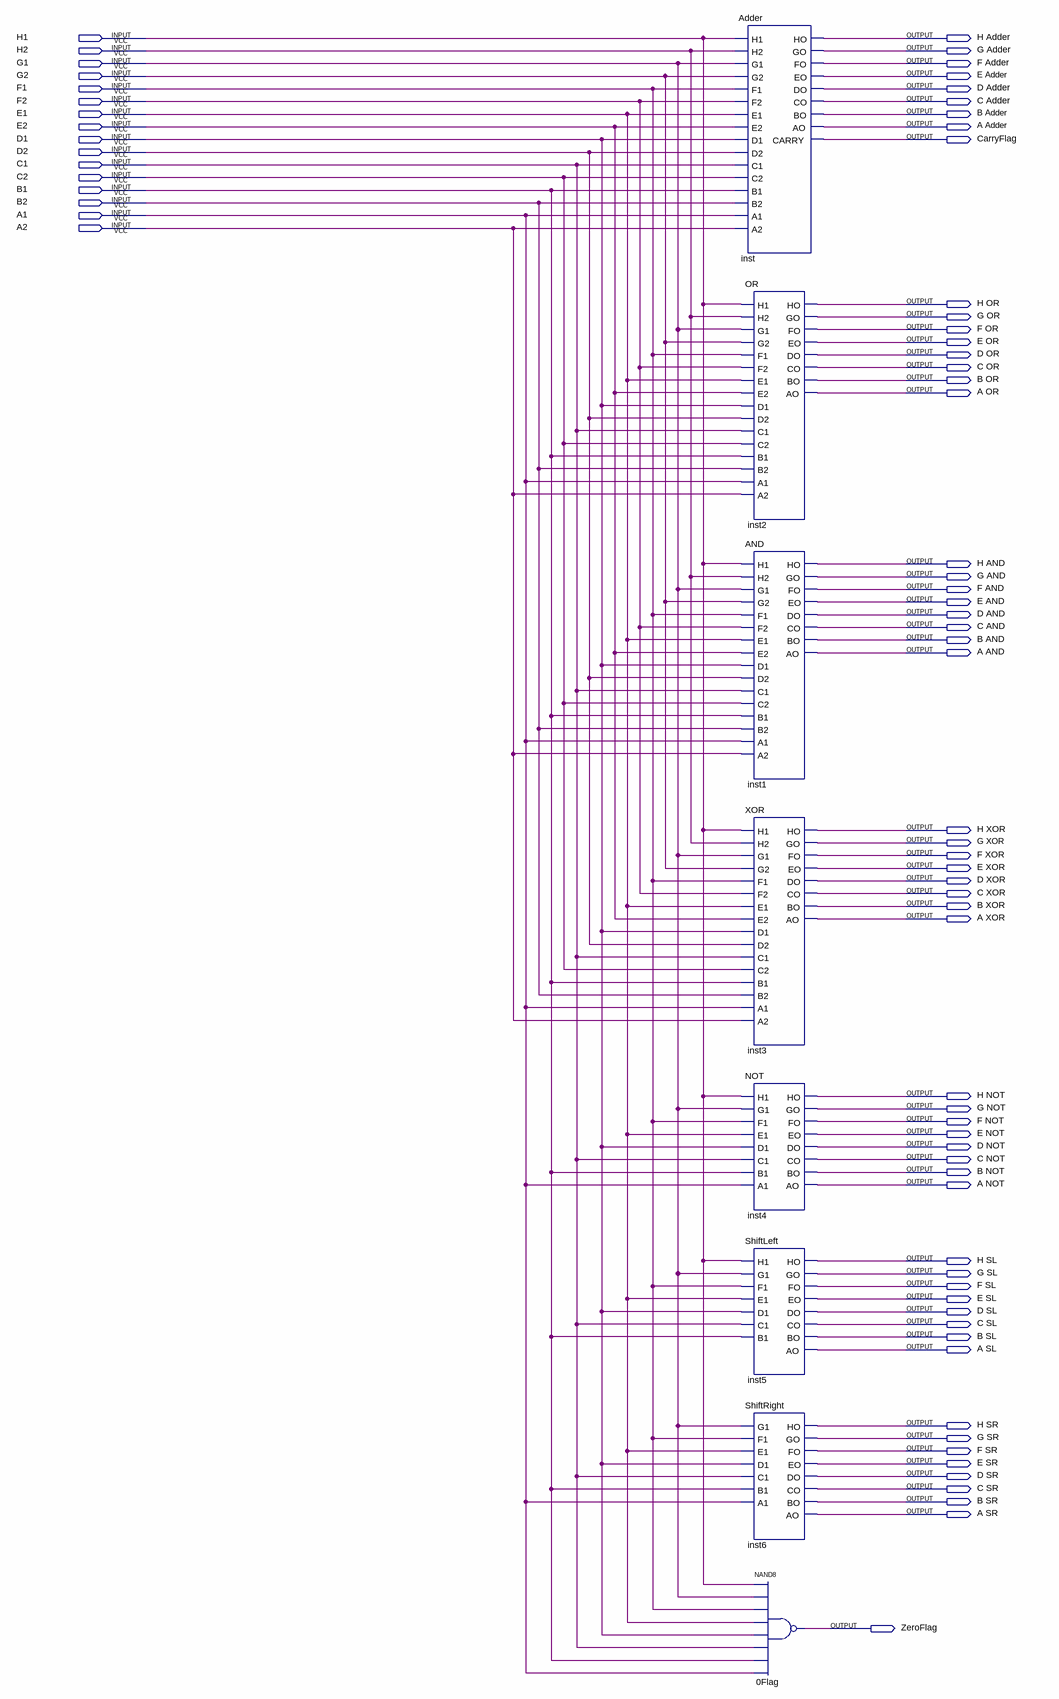
[diagram p0: schematic sheet]
// Quartus schematic ALU.bdf as structural Verilog: 8 symbols, 74 pins
module ALU (
  input  H1,
  input  H2,
  input  G1,
  input  G2,
  input  F1,
  input  F2,
  input  E1,
  input  E2,
  input  D1,
  input  D2,
  input  C1,
  input  C2,
  input  B1,
  input  B2,
  input  A1,
  input  A2,
  output \H_Adder ,
  output \G_Adder ,
  output \F_Adder ,
  output \E_Adder ,
  output \D_Adder ,
  output \C_Adder ,
  output \B_Adder ,
  output \A_Adder ,
  output CarryFlag,
  output \H_OR ,
  output \G_OR ,
  output \F_OR ,
  output \E_OR ,
  output \D_OR ,
  output \C_OR ,
  output \B_OR ,
  output \A_OR ,
  output \H_AND ,
  output \G_AND ,
  output \F_AND ,
  output \E_AND ,
  output \D_AND ,
  output \C_AND ,
  output \B_AND ,
  output \A_AND ,
  output \H_XOR ,
  output \G_XOR ,
  output \F_XOR ,
  output \E_XOR ,
  output \D_XOR ,
  output \C_XOR ,
  output \B_XOR ,
  output \A_XOR ,
  output \H_NOT ,
  output \G_NOT ,
  output \F_NOT ,
  output \E_NOT ,
  output \D_NOT ,
  output \C_NOT ,
  output \B_NOT ,
  output \A_NOT ,
  output \H_SL ,
  output \G_SL ,
  output \F_SL ,
  output \E_SL ,
  output \D_SL ,
  output \C_SL ,
  output \B_SL ,
  output \A_SL ,
  output \H_SR ,
  output \G_SR ,
  output \F_SR ,
  output \E_SR ,
  output \D_SR ,
  output \C_SR ,
  output \B_SR ,
  output \A_SR ,
  output ZeroFlag
);

  Adder inst (
    .H1(H1), .H2(H2), .G1(G1), .G2(G2), .F1(F1), .F2(F2), .E1(E1), .E2(E2), .D1(D1), .D2(D2), .C1(C1),
    .C2(C2), .B1(B1), .B2(B2), .A1(A1), .A2(A2), .HO(\H_Adder ), .GO(\G_Adder ), .FO(\F_Adder ),
    .EO(\E_Adder ), .DO(\D_Adder ), .CO(\C_Adder ), .BO(\B_Adder ), .AO(\A_Adder ), .CARRY(CarryFlag));
  OR inst2 (
    .H1(H1), .H2(H2), .G1(G1), .G2(G2), .F1(F1), .F2(F2), .E1(E1), .E2(E2), .D1(D1), .D2(D2), .C1(C1),
    .C2(C2), .B1(B1), .B2(B2), .A1(A1), .A2(A2), .HO(\H_OR ), .GO(\G_OR ), .FO(\F_OR ), .EO(\E_OR ),
    .DO(\D_OR ), .CO(\C_OR ), .BO(\B_OR ), .AO(\A_OR ));
  AND inst1 (
    .H1(H1), .H2(H2), .G1(G1), .G2(G2), .F1(F1), .F2(F2), .E1(E1), .E2(E2), .D1(D1), .D2(D2), .C1(C1),
    .C2(C2), .B1(B1), .B2(B2), .A1(A1), .A2(A2), .HO(\H_AND ), .GO(\G_AND ), .FO(\F_AND ), .EO(\E_AND ),
    .DO(\D_AND ), .CO(\C_AND ), .BO(\B_AND ), .AO(\A_AND ));
  XOR inst3 (
    .H1(H1), .H2(H2), .G1(G1), .G2(G2), .F1(F1), .F2(F2), .E1(E1), .E2(E2), .D1(D1), .D2(D2), .C1(C1),
    .C2(C2), .B1(B1), .B2(B2), .A1(A1), .A2(A2), .HO(\H_XOR ), .GO(\G_XOR ), .FO(\F_XOR ), .EO(\E_XOR ),
    .DO(\D_XOR ), .CO(\C_XOR ), .BO(\B_XOR ), .AO(\A_XOR ));
  NOT inst4 (
    .H1(H1), .G1(G1), .F1(F1), .E1(E1), .D1(D1), .C1(C1), .B1(B1), .A1(A1), .HO(\H_NOT ), .GO(\G_NOT ),
    .FO(\F_NOT ), .EO(\E_NOT ), .DO(\D_NOT ), .CO(\C_NOT ), .BO(\B_NOT ), .AO(\A_NOT ));
  ShiftLeft inst5 (
    .H1(H1), .G1(G1), .F1(F1), .E1(E1), .D1(D1), .C1(C1), .B1(B1), .HO(\H_SL ), .GO(\G_SL ), .FO(\F_SL ),
    .EO(\E_SL ), .DO(\D_SL ), .CO(\C_SL ), .BO(\B_SL ), .AO(\A_SL ));
  ShiftRight inst6 (
    .G1(G1), .F1(F1), .E1(E1), .D1(D1), .C1(C1), .B1(B1), .A1(A1), .HO(\H_SR ), .GO(\G_SR ), .FO(\F_SR ),
    .EO(\E_SR ), .DO(\D_SR ), .CO(\C_SR ), .BO(\B_SR ), .AO(\A_SR ));
  nand u_0Flag (ZeroFlag, H1, G1, F1, E1, D1, C1, B1, A1);
endmodule
